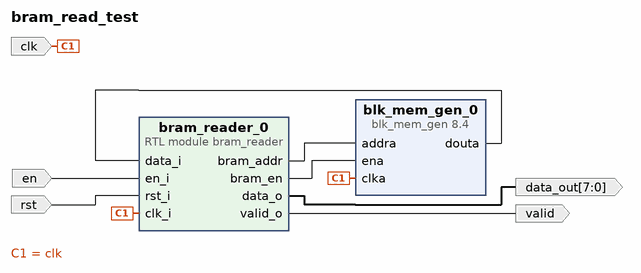
[diagram p0: block diagram of the top level]
# Vivado block design bram_read_test, xck26-sfvc784-2LV-c, Vivado 2022.2
create_bd_design bram_read_test

create_bd_port -dir I clk
create_bd_port -dir I rst
create_bd_port -dir I en
create_bd_port -dir O -from 7 -to 0 data_out
create_bd_port -dir O valid

create_bd_cell -type ip -vlnv xilinx.com:ip:blk_mem_gen:8.4 blk_mem_gen_0
set_property -dict [list \
  CONFIG.Coe_File data_bram.coe \
  CONFIG.Load_Init_File true \
  CONFIG.use_bram_block Stand_Alone \
] [get_bd_cells blk_mem_gen_0]
create_bd_cell -type module -reference bram_reader bram_reader_0

# ---- connections ----

connect_bd_net [get_bd_pins blk_mem_gen_0/douta] [get_bd_pins bram_reader_0/data_i]
connect_bd_net -net bram_reader_0_bram_addr_in [get_bd_pins bram_reader_0/bram_addr] [get_bd_pins blk_mem_gen_0/addra]
connect_bd_net [get_bd_pins bram_reader_0/bram_en] [get_bd_pins blk_mem_gen_0/ena]
connect_bd_net [get_bd_pins bram_reader_0/data_o] [get_bd_ports data_out]
connect_bd_net [get_bd_pins bram_reader_0/valid_o] [get_bd_ports valid]
connect_bd_net [get_bd_ports clk] [get_bd_pins blk_mem_gen_0/clka] [get_bd_pins bram_reader_0/clk_i]
connect_bd_net [get_bd_ports en] [get_bd_pins bram_reader_0/en_i]
connect_bd_net [get_bd_ports rst] [get_bd_pins bram_reader_0/rst_i]

validate_bd_design
save_bd_design
